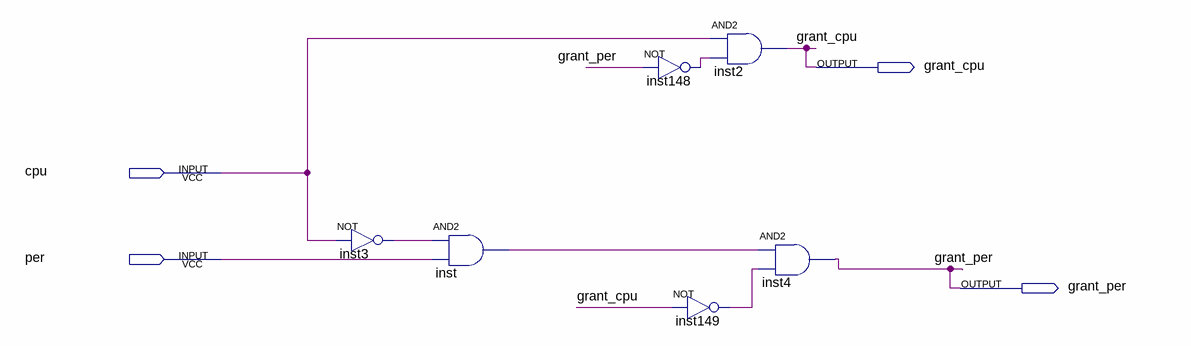
[diagram p0: schematic sheet]
// Quartus schematic arbitr.bdf as structural Verilog: 6 symbols, 4 pins
module arbitr (
  input  cpu,
  input  per,
  output grant_cpu,
  output grant_per
);

  wire inst3_out, inst148_out, inst149_out, inst_out;

  not inst3 (inst3_out, cpu);
  and inst (inst_out, inst3_out, per);
  not inst148 (inst148_out, grant_per);
  and inst2 (grant_cpu, cpu, inst148_out);
  not inst149 (inst149_out, grant_cpu);
  and inst4 (grant_per, inst_out, inst149_out);
endmodule
